# Altium schematic sheet CC2530传感器全部合在一起.SchDoc
size A3
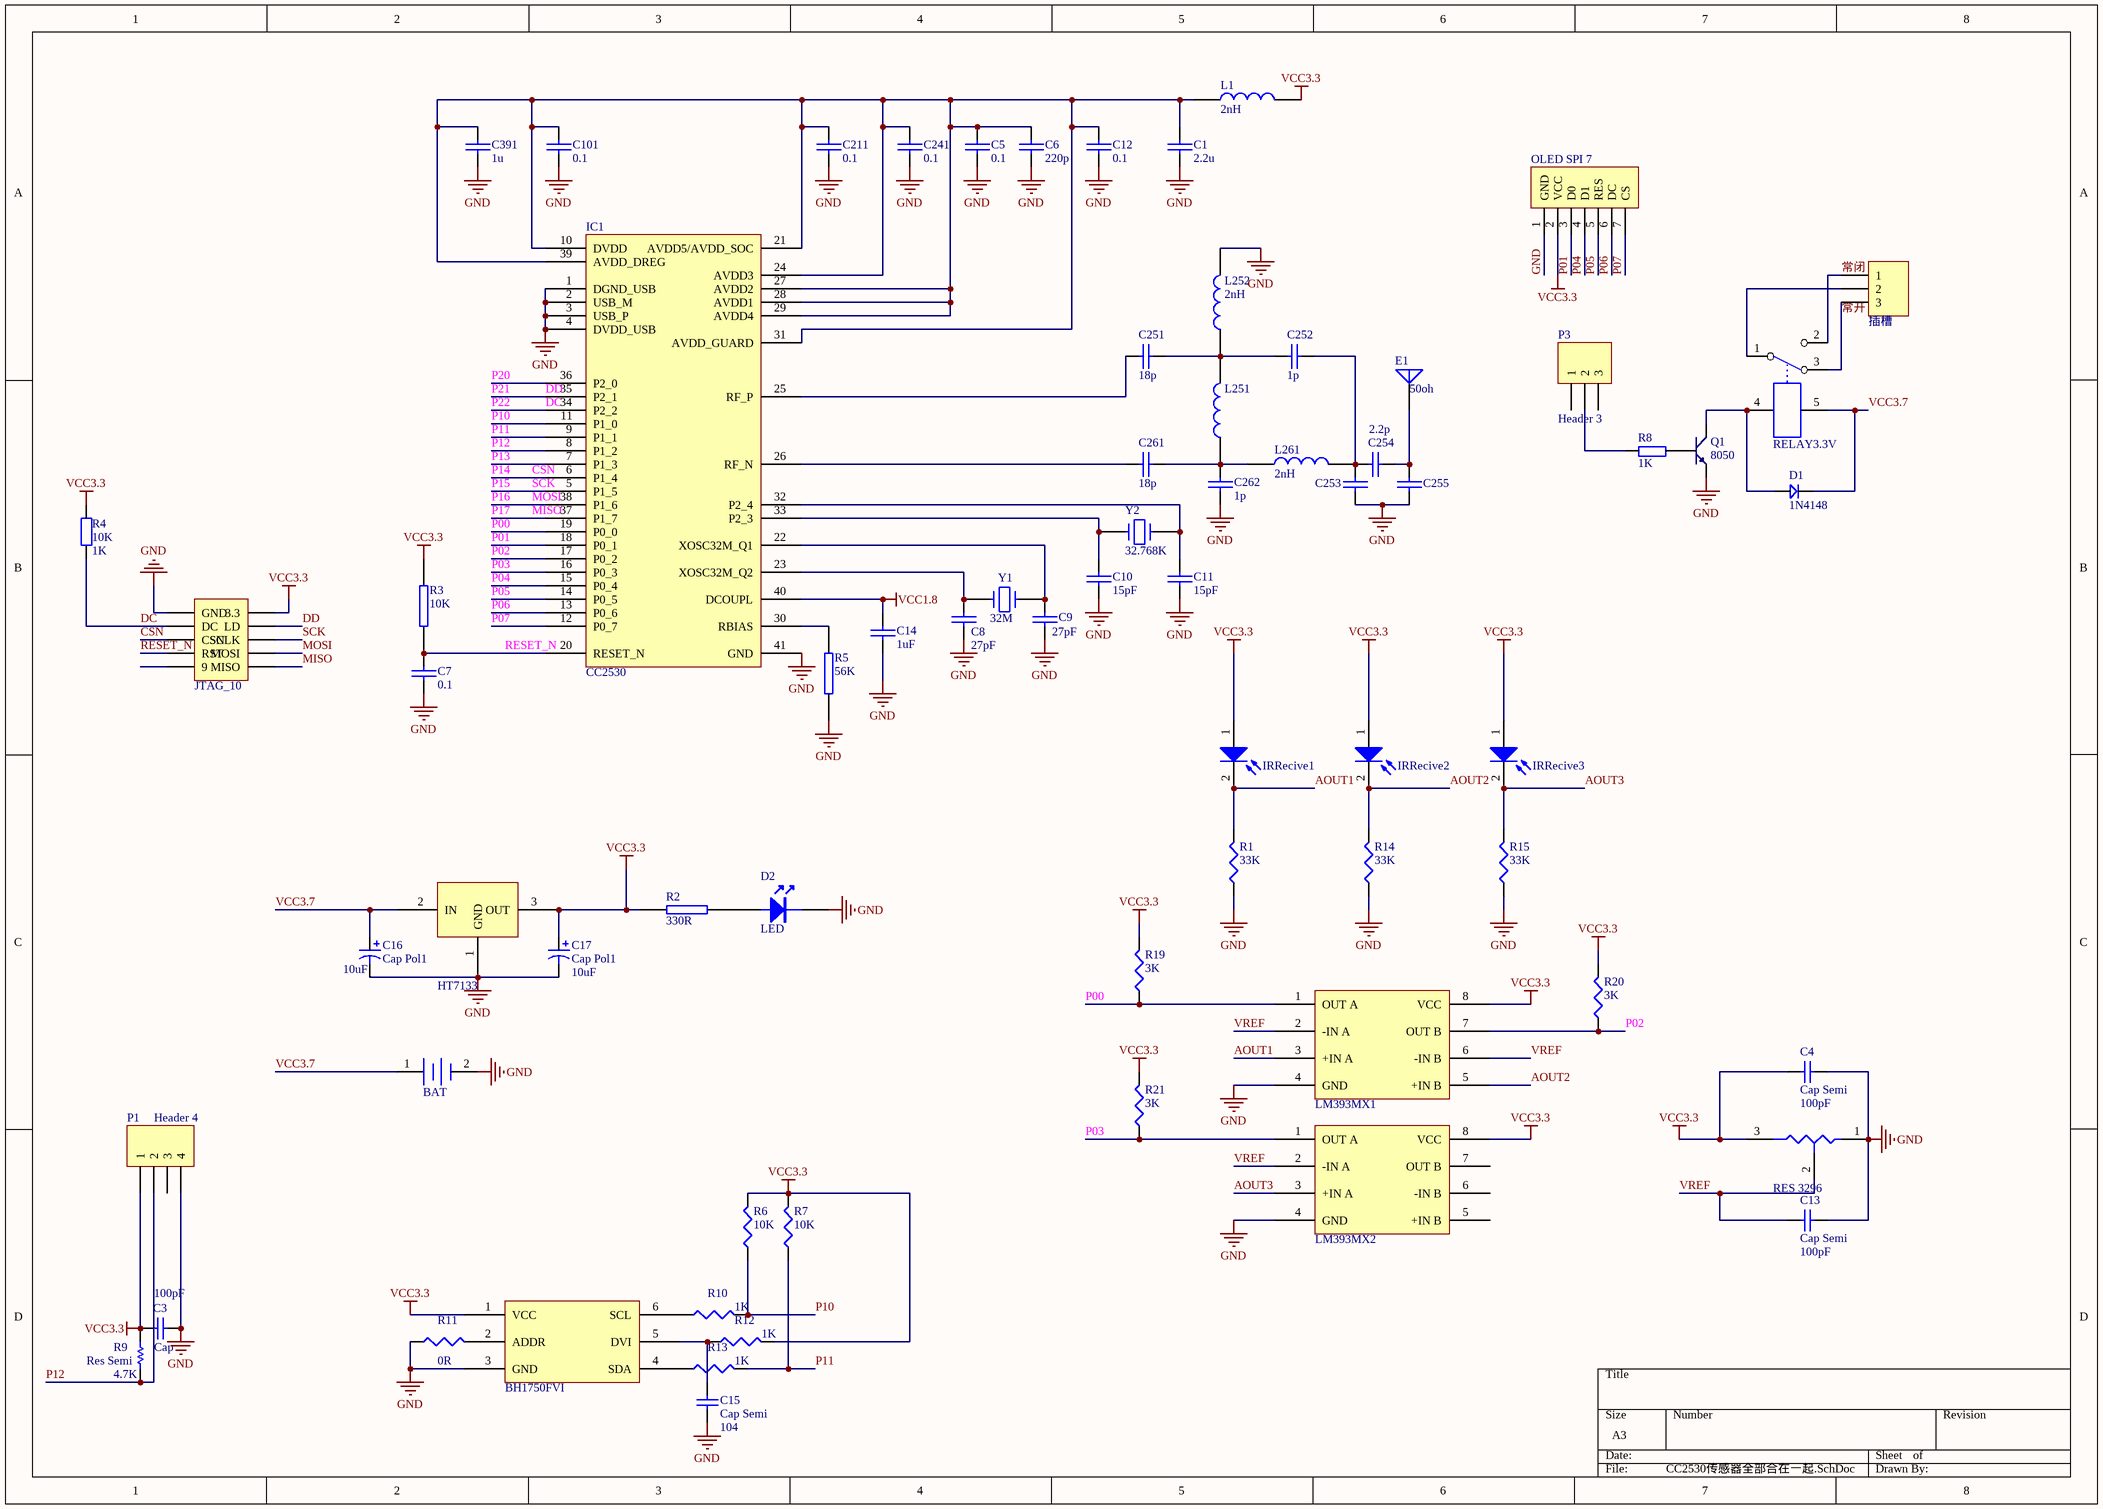
[diagram p0: CC2530传感器全部合在一起.SchDoc]

## Parts
BAT  BAT  [BAT]  (value not drawn)
BH1750FVI  BH1750FVI  [BH1750FVI]  (value not drawn)
C1  2.2u  [J1-0603]
C3  Cap  value 100pF  [J1-0603]
C4  Cap Semi  value 100pF  [3.5X2.8X1.9]
C5  0.1  [J1-0603]
C6  220p  [J1-0603]
C7  0.1  [J1-0603]
C8  27pF  [J1-0603]
C9  27pF  [J1-0603]
C10  15pF  [J1-0603]
C11  15pF  [J1-0603]
C12  0.1  [J1-0603]
C13  Cap Semi  value 100pF  [3.5X2.8X1.9]
C14  1uF  [J1-0603]
C15  Cap Semi  value 104  [3.5X2.8X1.9]
C16  Cap Pol1  value 10uF  [3.5X2.8X1.9]
C17  Cap Pol1  value 10uF  [3.5X2.8X1.9]
C101  0.1  [J1-0603]
C211  0.1  [J1-0603]
C241  0.1  [J1-0603]
C251  18p  [J1-0603]
C252  1p  [J1-0603]
C253  (no value)  [J1-0603]
C254  2.2p  [J1-0603]
C255  (no value)  [J1-0603]
C261  18p  [J1-0603]
C262  1p  [J1-0603]
C391  1u  [J1-0603]
D1  1N4148  [C1206]
D2  LED  [3.2X1.6X1.1]
E1  50oh  [ANT]
HT7133  HT7133  [HT7133]  (value not drawn)
IC1  CC2530  [QFN40_RHA]
IRRecive1  IRRecive  [IRRecive]  (value not drawn)
IRRecive2  IRRecive  [IRRecive]  (value not drawn)
IRRecive3  IRRecive  [IRRecive]  (value not drawn)
JTAG_10  JTAG_10  [JTAG_10]  (value not drawn)
L1  2nH  [J1-0603]
L251  (no value)  [J1-0603]
L252  2nH  [J1-0603]
L261  2nH  [J1-0603]
LM393MX1  LM393MX  [LM393MX]  (value not drawn)
LM393MX2  LM393MX  [LM393MX]  (value not drawn)
OLED_SPI_7  OLED SPI 7  [OLED SPI 7]  (value not drawn)
P1  Header 4  [HDR1X4]
P3  Header 3  [HDR1X3]
Q1  8050  [SOT-23R]
R1  value 33K  [J1-0603]  (hidden comment: Res3)
R2  330R  [J1-0603]
R3  10K  [J1-0603]
R4  10K  value 1K  [J1-0603]
R5  56K  [J1-0603]
R6  value 10K  [J1-0603]  (hidden comment: Res3)
R7  value 10K  [J1-0603]  (hidden comment: Res3)
R8  1K  [J1-0603]
R9  Res Semi  value 4.7K  [J1-0603]
R10  value 1K  [J1-0603]  (hidden comment: Res3)
R11  value 0R  [J1-0603]  (hidden comment: Res3)
R12  value 1K  [J1-0603]  (hidden comment: Res3)
R13  value 1K  [J1-0603]  (hidden comment: Res3)
R14  value 33K  [J1-0603]  (hidden comment: Res3)
R15  value 33K  [J1-0603]  (hidden comment: Res3)
R19  value 3K  [J1-0603]  (hidden comment: Res3)
R20  value 3K  [J1-0603]  (hidden comment: Res3)
R21  value 3K  [J1-0603]  (hidden comment: Res3)
RELAY3.3V  RELAY3.3V  [RELAY3.3V]  (value not drawn)
RES_3296  RES 3296  [RES 3296]  (value not drawn)
Y1  32M  [XTAL_US]
Y2  32.768K  [XTAL 32M]
插槽  插槽  [杜邦线插槽]  (value not drawn)

## Nets
GND: BAT.2(-) BH1750FVI.3(GND) C1.2 C3.2 C4.2 C5.2 C6.2 C7.2 C8.2 C9.2 C10.2 C11.2 C12.2 C13.2 C14.2 C15.1 C16.2 C17.2 C101.2 C211.2 C241.2 C253.2 C255.1 C262.2 C391.2 D2.K HT7133.1(GND) IC1.1(DGND_USB) IC1.2(USB_M) IC1.3(USB_P) IC1.4(DVDD_USB) IC1.41(GND) JTAG_10.1(GND) L252.2 LM393MX1.4(GND) LM393MX2.4(GND) OLED_SPI_7.1(GND) P1.4 Q1.1(E) R1.1 R5.2 R11.1 R14.1 R15.1 RES_3296.1(A)
VCC1.8: C14.1 IC1.40(DCOUPL)
VCC3.3: BH1750FVI.1(VCC) C3.1 C4.1 C17.1 HT7133.3(OUT) IRRecive1.1(A) IRRecive2.1(A) IRRecive3.1(A) JTAG_10.2(3.3) L1.2 LM393MX1.8(VCC) LM393MX2.8(VCC) OLED_SPI_7.2(VCC) P1.1 R2.2 R3.2 R4.2 R6.2 R7.2 R9.2 R12.2 R19.2 R20.2 R21.2 RES_3296.3(B)
AOUT1: IRRecive1.2(K) LM393MX1.3(+IN_A) R1.2
AOUT2: IRRecive2.2(K) LM393MX1.5(+IN_B) R14.2
AOUT3: IRRecive3.2(K) LM393MX2.3(+IN_A) R15.2
CSN: IC1.6(P1_4) JTAG_10.5(CSN)  [also labelled P14]
DC: IC1.34(P2_2) JTAG_10.3(DC) R4.1  [also labelled P22]
DD: IC1.35(P2_1) JTAG_10.4(LD)  [also labelled P21]
MISO: IC1.37(P1_7) JTAG_10.10(MISO)  [also labelled P17]
MOSI: IC1.38(P1_6) JTAG_10.8(MOSI)  [also labelled P16]
P00: IC1.19(P0_0) LM393MX1.1(OUT_A) R19.1
P01: IC1.18(P0_1) OLED_SPI_7.3(D0)
P02: IC1.17(P0_2) LM393MX1.7(OUT_B) R20.1
P03: IC1.16(P0_3) LM393MX2.1(OUT_A) R21.1
P04: IC1.15(P0_4) OLED_SPI_7.4(D1)
P05: IC1.14(P0_5) OLED_SPI_7.5(RES)
P06: IC1.13(P0_6) OLED_SPI_7.6(DC)
P07: IC1.12(P0_7) OLED_SPI_7.7(CS)
P10: IC1.11(P1_0) R6.1 R10.2
P11: IC1.9(P1_1) R7.1 R13.2
P12: IC1.8(P1_2) P1.2 R9.1
P13: IC1.7(P1_3)
P15: IC1.5(P1_5) JTAG_10.6(SCLK)  [also labelled SCK]
P20: IC1.36(P2_0)
RESET_N: C7.1 IC1.20(RESET_N) JTAG_10.7(RST) R3.1
VCC3.7: BAT.1(+) C16.1 D1.2 HT7133.2(IN) RELAY3.3V.5
VREF: C13.1 LM393MX1.2(-IN_A) LM393MX1.6(-IN_B) LM393MX2.2(-IN_A) RES_3296.2(TAP)
常开: RELAY3.3V.3 插槽.3
常闭: RELAY3.3V.2 插槽.1
NetBH1750FVI_2: BH1750FVI.2(ADDR) R11.2
NetBH1750FVI_4: BH1750FVI.4(SDA) R13.1
NetBH1750FVI_5: BH1750FVI.5(DVI) C15.2 R12.1
NetBH1750FVI_6: BH1750FVI.6(SCL) R10.1
NetC1_1: C1.1 C5.1 C6.1 C12.1 C101.1 C211.1 C241.1 C391.1 IC1.10(DVDD) IC1.21(AVDD5/AVDD_SOC) IC1.24(AVDD3) IC1.27(AVDD2) IC1.28(AVDD1) IC1.29(AVDD4) IC1.31(AVDD_GUARD) IC1.39(AVDD_DREG) L1.1
NetC8_1: C8.1 IC1.23(XOSC32M_Q2) Y1.1
NetC9_1: C9.1 IC1.22(XOSC32M_Q1) Y1.2
NetC10_1: C10.1 IC1.33(P2_3) Y2.2
NetC11_1: C11.1 IC1.32(P2_4) Y2.1
NetC251_1: C251.1 IC1.25(RF_P)
NetC251_2: C251.2 C252.1 L251.2 L252.1
NetC252_2: C252.2 C253.1 C254.1 L261.2
NetC254_2: C254.2 C255.2 E1.1(A)
NetC261_1: C261.1 IC1.26(RF_N)
NetC261_2: C261.2 C262.1 L251.1 L261.1
NetD1_1: D1.1 Q1.3(C) RELAY3.3V.4
NetD2_A: D2.A R2.1
NetIC1_30: IC1.30(RBIAS) R5.1
NetP3_2: P3.2 R8.1
NetQ1_2: Q1.2(B) R8.2
NetRELAY3.3V_1: RELAY3.3V.1 插槽.2

Not connected (* = marked no-connect by the designer): JTAG_10 9; LM393MX2 5(+IN_B) 6(-IN_B) 7(OUT_B); P1 3; P3 1 3

## Library data of the parts
C1 C5-C12 C14 C101 C211 C241 C251-C255 C261 C262 C391 = CAP: Capacitor
C3 = Cap: Capacitor; Published: 8-Jun-2000; LatestRevisionDate: 17-Jul-2002; LatestRevisionNote: Re-released for DXP Platform.; PackageReference: RAD-0.3; Publisher: Altium Limited; PackageDescription: Radial Cap, Thru-Hole; 2 Leads; 0.3 in Pin Spacing
C4 C13 C15 = Cap Semi: Capacitor (Semiconductor SIM Model); Published: 8-Jun-2000; LatestRevisionDate: 29-May-2009; LatestRevisionNote: IPC-7351 Footprint Added.; PackageReference: C1206; Publisher: Altium Limited; PackageDescription: Chip Capacitor
C16 C17 = Cap Pol1: Polarized Capacitor (Radial); Published: 8-Jun-2000; LatestRevisionDate: 17-Jul-2002; LatestRevisionNote: Re-released for DXP Platform.; PackageReference: RB7.6-15; Publisher: Altium Limited; PackageDescription: Polarized Capacitor (Radial); 2 Leads
D1 = D
E1 = ANTENNA: Generic Antenna
L1 L251 L252 L261 = INDUCTOR
P1 = Header 4: Header, 4-Pin; LatestRevisionDate: 17-Jul-2002; LatestRevisionNote: Re-released for DXP Platform.; Publisher: Altium Limited
P3 = Header 3: Header, 3-Pin; LatestRevisionDate: 17-Jul-2002; LatestRevisionNote: Re-released for DXP Platform.; Publisher: Altium Limited
Q1 = NPN: 8050/BCW846/BCW847
R1 R6 R7 R10-R15 R19-R21 = Res3: Resistor; Published: 8-Jun-2000; LatestRevisionDate: 29-May-2009; LatestRevisionNote: IPC-7351 Footprint Added.; PackageReference: J1-0603; Publisher: Altium Limited; PackageDescription: Chip Resistor
R2 R3 R5 = RES2
R4 = res0402
R8 = R
R9 = Res Semi: Semiconductor Resistor; Published: 8-Jun-2000; LatestRevisionDate: 17-Jul-2002; LatestRevisionNote: Re-released for DXP Platform.; PackageReference: AXIAL-0.5; Publisher: Altium Limited; PackageDescription: Axial Device, Thru-Hole; 2 Leads; 0.5 in Pin Spacing
Y1 Y2 = CRYSTAL